# EAGLE design IOB-RR-CirKits (EAGLE 7.7.0)
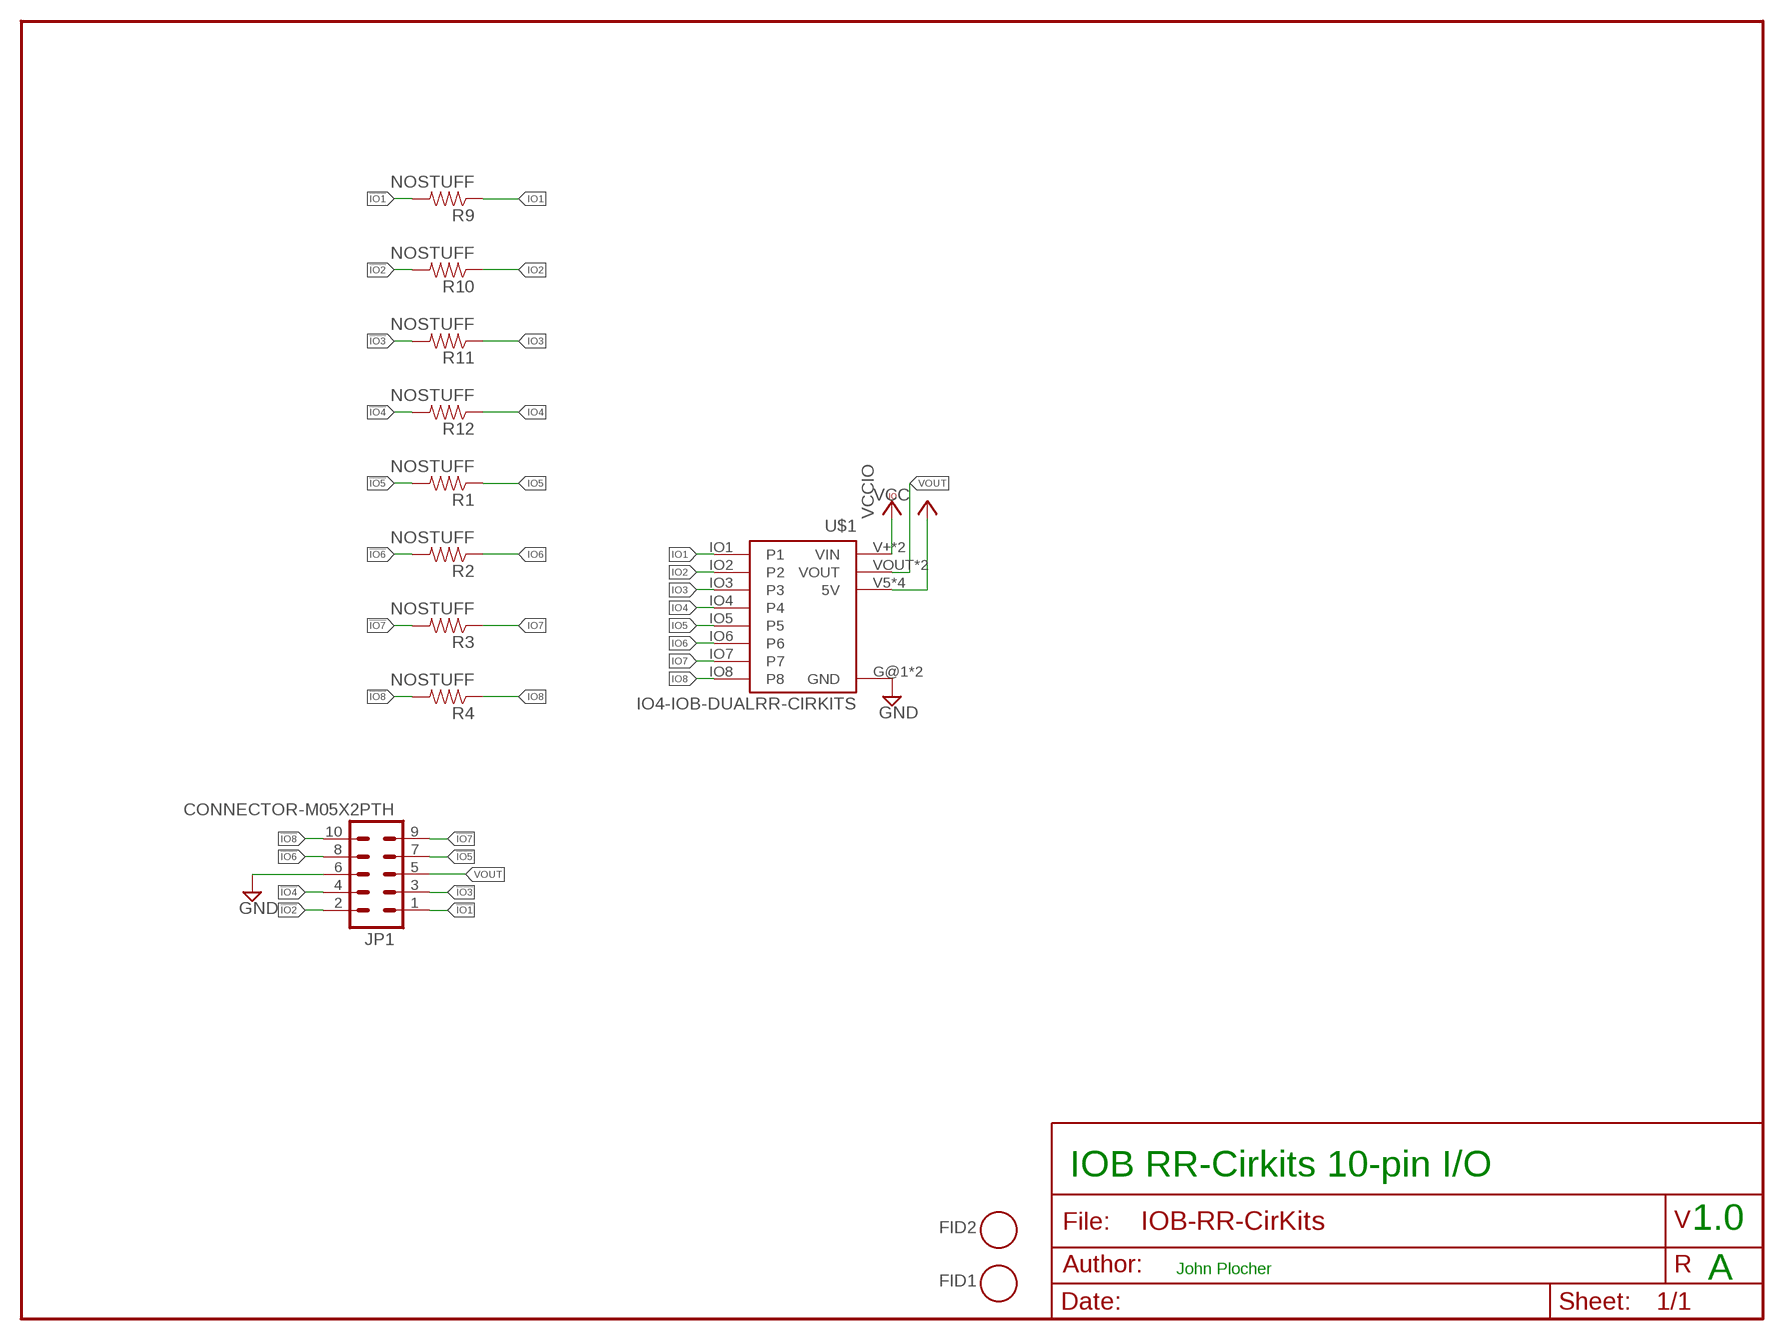
[diagram p0: schematic, sheet 1]

## Parts
FID1  FIDUCIAL  [FIDUCIAL_1MM]
FID2  FIDUCIAL  [FIDUCIAL_1MM]
JP1  CONNECTOR-M05X2PTH  [AVR_ICSP]
R1  NOSTUFF  RPTH-R0  [CUT-R]
R2  NOSTUFF  RPTH-R0  [CUT-R]
R3  NOSTUFF  RPTH-R0  [CUT-R]
R4  NOSTUFF  RPTH-R0  [CUT-R]
R9  NOSTUFF  RPTH-R0  [CUT-R]
R10  NOSTUFF  RPTH-R0  [CUT-R]
R11  NOSTUFF  RPTH-R0  [CUT-R]
R12  NOSTUFF  RPTH-R0  [CUT-R]
U$1  IO4-IOB-DUALRR-CIRKITS  [10X-IOB]

## Nets
!IO1 [signals]: JP1.1 R9.P1
!IO2 [signals]: JP1.2 R10.P1
!IO3 [signals]: JP1.3 R11.P1
!IO4 [signals]: JP1.4 R12.P1
!IO5 [signals]: JP1.7 R1.P1
!IO6 [signals]: JP1.8 R2.P1
!IO7 [signals]: JP1.9 R3.P1
!IO8 [signals]: JP1.10 R4.P1
GND [Power]: JP1.6 U$1.G@1(GND) U$1.G@3(GND)
IO1: R9.P2 U$1.IO1(P1)
IO2: R10.P2 U$1.IO2(P2)
IO3: R11.P2 U$1.IO3(P3)
IO4: R12.P2 U$1.IO4(P4)
IO5: R1.P2 U$1.IO5(P5)
IO6: R2.P2 U$1.IO6(P6)
IO7: R3.P2 U$1.IO7(P7)
IO8: R4.P2 U$1.IO8(P8)
VCC [Power]: U$1.V5(5V) U$1.V5@1(5V) U$1.V5@2(5V) U$1.V5@3(5V)
VCCIO: U$1.V+(VIN) U$1.V+@1(VIN)
VOUT [Power]: JP1.5 U$1.VOUT U$1.VOUT@1(VOUT)

## Notes on the sheet
- IOB RR-Cirkits 10-pin I/O
- 1.0
- John Plocher
- A

## Library data of the parts
FID1 FID2 = SPCoast:FIDUCIAL: For use by pick and place machines to calibrate the vision/machine, 1mm By microbuilder.eu
JP1 = SPCoast:CONNECTOR-M05X2: Header 5x2 Standard 10-pin dual row 0.1" header. Commonly used with AVR-ISP. Use with Spark Fun Electronics SKU: PRT-00778
R1-R4 R9-R12 = SPCoast:R*: Resistor Basic schematic elements and footprints for 0603, 1206, and PTH 1/10th watt (small) resistors.
U$1 = SPCoast:IO4-IOB-DUAL

## Net classes
0 default: width 0.254 mm, drill 0.4 mm, clearance 0.127 mm
1 Power: width 0.254 mm, drill 0.4 mm, clearance 0.127 mm
2 signals: width 0.254 mm, drill 0.4 mm, clearance 0.127 mm

## Board
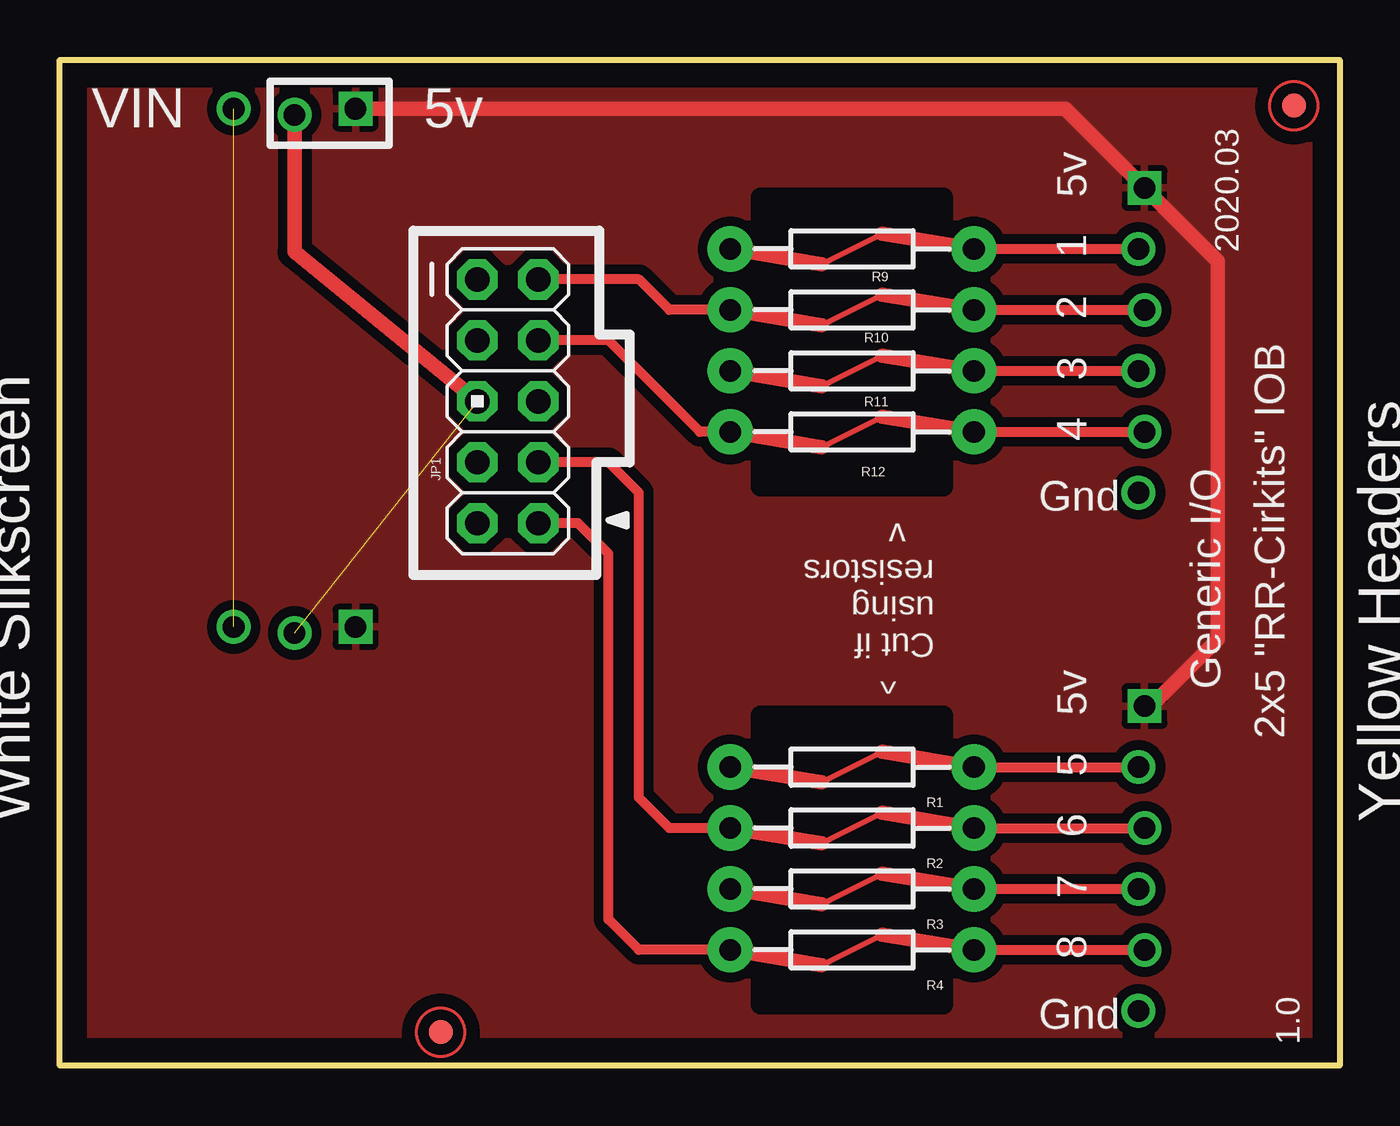
[diagram p1: board, top side]
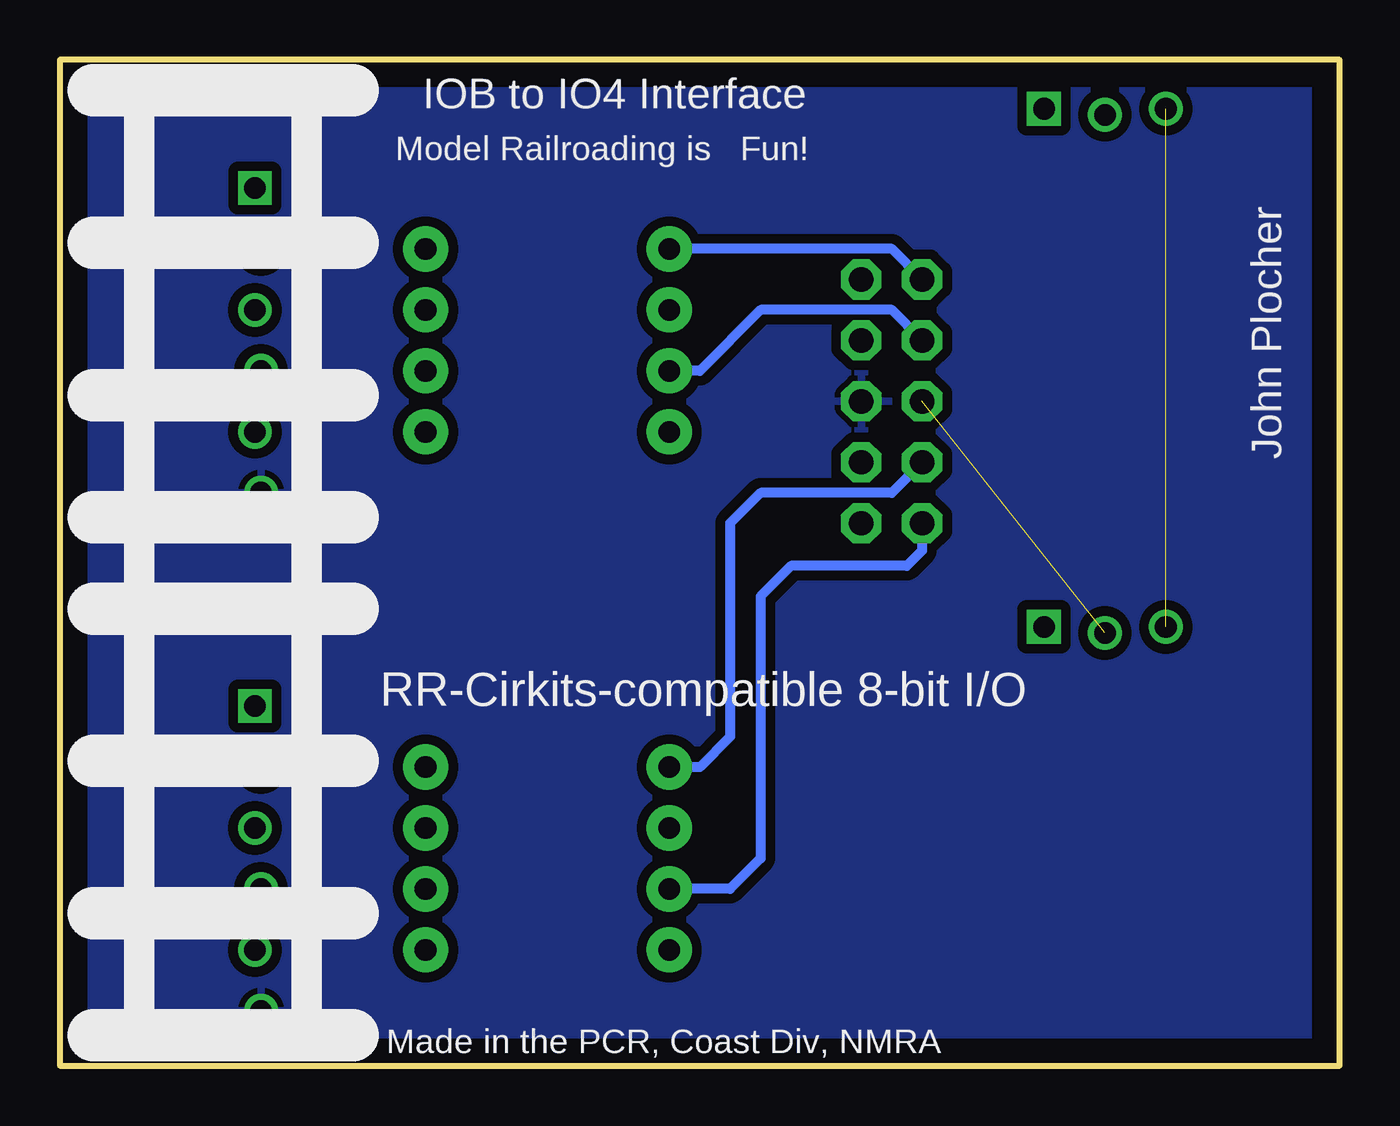
[diagram p2: board, bottom side, seen from below]

Size 53.34 x 41.91 mm. Coordinates in mm from the lower left corner, seen from the top.
Outline: 0,0 0,41.91 53.34,41.91 53.34,0 0,0
Copper layers (1*16): Top 0.035mm / dielectric 1.5mm / Bottom 0.035mm
Design rules "default *": minimum track width 10mil, minimum drill 0.4mm, track to track 8mil, track to pad 8mil, pad to pad 8mil, via to via 8mil, smd to smd 8mil, copper to edge 40mil, drill to drill 8mil, minimum pad ring 10mil, minimum via ring 8mil, stop-mask expansion 4mil, vias tented up to drill 0mil, thermal gap 10mil
tRestrict: area 29.2,24.1 to 36.8,36.2; area 29.2,2.5 to 36.8,14.6

### Footprints (pad centres in the part's own frame; a part is rotated, then mirrored left to right if it is on the bottom)
FIDUCIAL_1MM = smd 1 x 1: 1 0,0
AVR_ICSP = drill 1.016 pad 1.676 octagon: 1 -1.27,5.08; 2 1.27,5.08; 3 -1.27,2.54; 4 1.27,2.54; 5 -1.27,0; 6 1.27,0; 7 -1.27,-2.54; 8 1.27,-2.54; 9 -1.27,-5.08; 10 1.27,-5.08
CUT-R = drill 0.9 pad 1.88: P1 5.08,0; P2 -5.08,0
10X-IOB = drill 0.9: G@1 44.958,23.876; G@3 44.958,2.286; IO1 44.958,34.036; IO2 45.212,31.496; IO3 44.958,28.956; IO4 45.212,26.416; IO5 44.958,12.446; IO6 45.212,9.906; IO7 44.958,7.366; IO8 45.212,4.826; V+ 7.239,18.288; V+@1 7.239,39.878; VOUT 9.779,18.034; VOUT@1 9.779,39.624 | drill 0.9 square: V5 12.319,18.288; V5@1 45.212,14.986; V5@2 45.212,36.576; V5@3 12.319,39.878

### Placement (x,y rotation side)
FID1  15.88,1.4 0 top
FID2  51.44,40.01 0 top
JP1  18.67,27.69 0 top
R1  33.02,12.45 180 top
R2  33.02,9.91 180 top
R3  33.02,7.37 180 top
R4  33.02,4.83 180 top
R9  33.02,34.04 180 top
R10  33.02,31.5 180 top
R11  33.02,28.96 180 top
R12  33.02,26.42 180 top
U$1  0,0 0 top

### Tracks (layer width: path | path; a pad name or v marks a point on that pad's centre or on a via)
!IO1
  Bottom 0.406: JP1.1 18.67,34.04 R9.P1
!IO2
  Top 0.406: R10.P1 25.4,31.5 24.13,32.77 JP1.2
!IO3
  Bottom 0.406: JP1.3 18.67,31.5 24.13,31.5 26.67,28.96 R11.P1
!IO4
  Top 0.406: R12.P1 26.67,26.42 22.86,30.23 JP1.4
!IO5
  Bottom 0.406: JP1.7 18.67,23.88 24.13,23.88 25.4,22.61 25.4,13.72 26.67,12.45 R1.P1
!IO6
  Top 0.406: R2.P1 25.4,9.91 24.13,11.18 24.13,23.88 22.86,25.15 JP1.8
!IO7
  Bottom 0.406: JP1.9 17.4,21.46 18.03,20.83 22.86,20.83 24.13,19.56 24.13,8.64 25.4,7.37 R3.P1
!IO8
  Top 0.406: R4.P1 24.13,4.83 22.86,6.1 22.86,21.34 21.59,22.61 JP1.10
GND
  pour Bottom (isolate 0.406): 0.38,41.53 0.38,0.38 52.96,0.38 52.96,41.53
IO1
  Top 0.406: R9.P2 U$1.IO1
IO2
  Top 0.406: R10.P2 U$1.IO2
IO3
  Top 0.406: R11.P2 U$1.IO3
IO4
  Top 0.406: R12.P2 U$1.IO4
IO5
  Top 0.406: R1.P2 U$1.IO5
IO6
  Top 0.406: R2.P2 U$1.IO6
IO7
  Top 0.406: R3.P2 U$1.IO7
IO8
  Top 0.406: R4.P2 U$1.IO8
VCC
  Top 0.61: U$1.V5@3 41.91,39.88 U$1.V5@2 48.26,33.53 48.26,17.78 45.47,14.99 U$1.V5@1
  pour Top (isolate 0.406): 0.38,41.53 0.38,0.38 52.96,0.38 52.96,41.53
VCCIO  (1 unrouted)
VOUT  (1 unrouted)
  Top 0.61: U$1.VOUT@1 9.78,33.91 JP1.5

### Text on the board
tPlace: 2020.03 | 2x5 "RR-Cirkits" IOB | Generic I/O | ^ / Cut if / using / resistors / v | Yellow Soldermask / White Silkscreen | Yellow Headers | 1.0
bPlace: John Plocher | RR-Cirkits-compatible 8-bit I/O
_tNames: R9 | R10 | R11 | R12 | JP1 | R1 | R2 | R3 | R4